# EAGLE design POE_V3 (EAGLE 9.6.2)
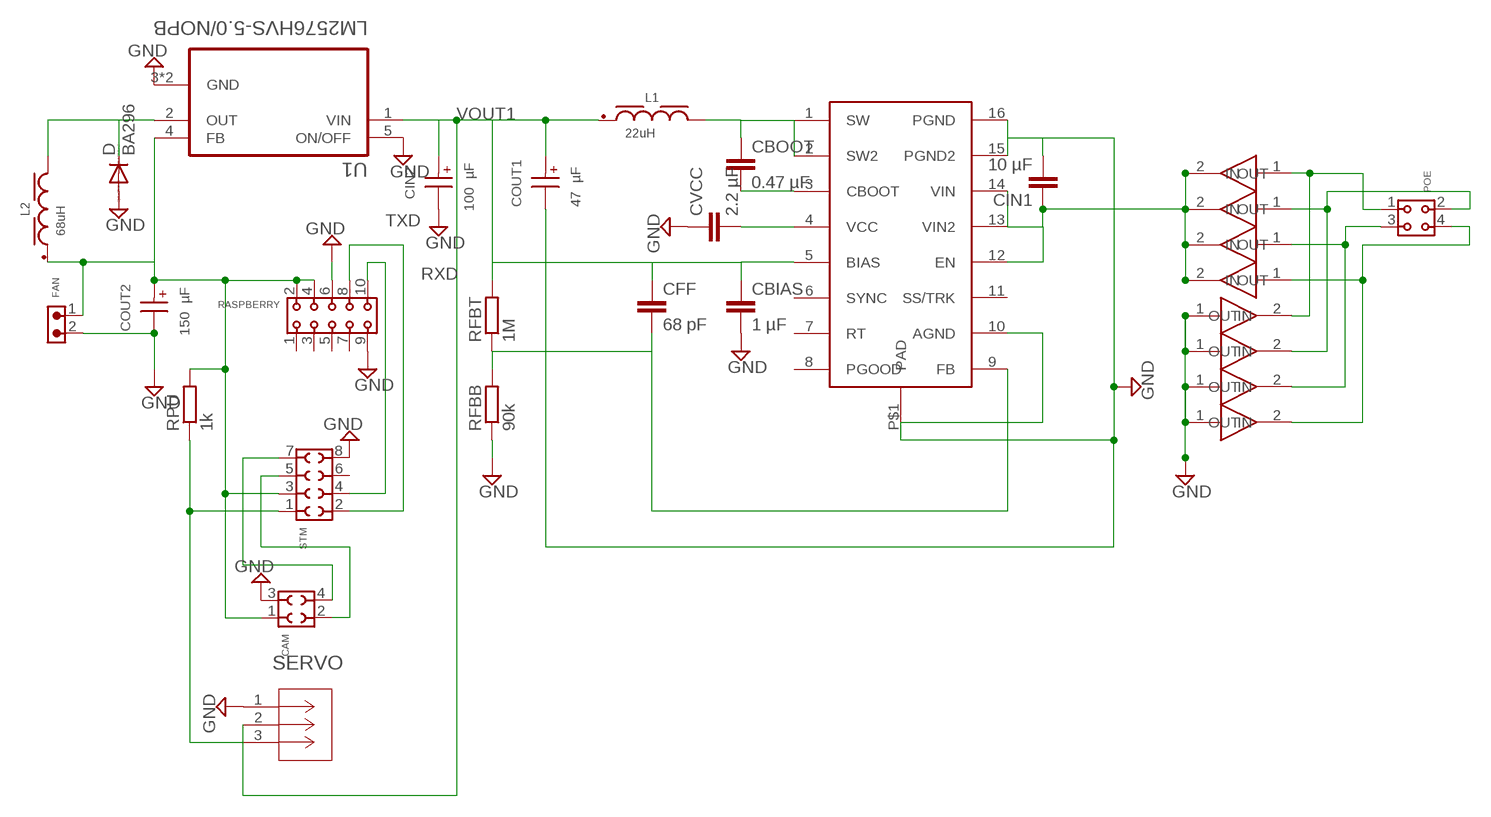
[diagram p0: schematic, sheet 1]

## Parts
CAM  6100XX21821_61000421821  [61000421821]
CBIAS  1 µF  C-EUC1206  [C1206]
CBOOT  0.47 µF  C-EUC1206  [C1206]
CFF  68 pF  C-EUC1206  [C1206]
CIN1  10 µF  C-EUC2220K  [C2220K]
CIN2  100 µF  WCAP-ASLI_6.3X5.5_865080343009  [WCAP-ASLI_6.3X5.5(DXL)]
COUT1  47 µF  WCAP-ASLI_5X5.5_865080342006  [WCAP-ASLI_5X5.5(DXL)]
COUT2  150 µF  WCAP-ASLI_6.3X5.5_865080143008  [WCAP-ASLI_6.3X5.5(DXL)]
CVCC  2.2 µF  C-EUC1206  [C1206]
D  BA296  [P2-15]
FAN  6130XX11021_61300211021  [61300211021]
L1  22uH  WE-PD_1260_744771122  [WE-PD_1260]
L2  68uH  WE-PD_1210_7447709680  [WE-PD_1210]
POE  6130XX21821_61300421821  [61300421821]
RASPBERRY  6130XX21821_61301021821  [61301021821]
RFBB  90k  R-EU_M1206  [M1206]
RFBT  1M  R-EU_M1206  [M1206]
RPU  1k  R-EU_M1206  [M1206]
SERVO  22035035  [CON_22035035]
STM  6100XX21821_61000821821  [61000821821]
U1  LM2576HVS-5.0/NOPB  [VREG_TPS79625KTTR]
U$1  LM46002  [TSSOP16]
U$2  RGF1D  [RGF1D]
U$3  RGF1D  [RGF1D]
U$4  RGF1D  [RGF1D]
U$5  RGF1D  [RGF1D]
U$6  RGF1D  [RGF1D]
U$7  RGF1D  [RGF1D]
U$8  RGF1D  [RGF1D]
U$9  RGF1D  [RGF1D]

## Nets
GND: CAM.3 CBIAS.2 CIN1.2 CIN2.2(-) COUT1.2(-) COUT2.2(-) CVCC.1 D.A FAN.2 RASPBERRY.6 RASPBERRY.9 RFBB.1 SERVO.1 STM.8 U1.3(GND) U1.5(ON/OFF) U1.6(GND) U$1.10(AGND) U$1.15(PGND2) U$1.16(PGND) U$1.P$1(PAD) U$4.1(IN) U$5.1(IN) U$8.1(IN) U$9.1(IN)
N$1: CBOOT.1 L1.2 U$1.1(SW) U$1.2(SW2)
N$2: CBOOT.2 U$1.3(CBOOT)
N$3: CVCC.2 U$1.4(VCC)
N$4: POE.1 U$2.1(IN) U$4.2(OUT)
N$5: POE.2 U$3.1(IN) U$5.2(OUT)
N$6: D.C L2.2 U1.2(OUT)
N$7: CAM.4 STM.7
N$8: CAM.2 STM.5
N$9: RPU.1 SERVO.3 STM.1
N$10: POE.3 U$6.1(IN) U$8.2(OUT)
N$11: POE.4 U$7.1(IN) U$9.2(OUT)
RFBT: CFF.2 RFBB.2 RFBT.1 U$1.9(FB)
RXD: RASPBERRY.10 STM.4
TXD: RASPBERRY.8 STM.2
VIN: CIN1.1 U$1.12(EN) U$1.13(VIN2) U$1.14(VIN) U$2.2(OUT) U$3.2(OUT) U$6.2(OUT) U$7.2(OUT)
VOUT1: CBIAS.1 CFF.1 CIN2.1(+) COUT1.1(+) L1.1 RFBT.2 SERVO.2 U1.1(VIN) U$1.5(BIAS)
VOUT2: CAM.1 COUT2.1(+) FAN.1 L2.1 RASPBERRY.2 RASPBERRY.4 RPU.2 STM.3 U1.4(FB)
Unconnected: RASPBERRY.1 RASPBERRY.3 RASPBERRY.5 RASPBERRY.7 STM.6 U$1.6(SYNC) U$1.7(RT) U$1.8(PGOOD) U$1.11(SS/TRK)

## Library data of the parts
CAM = Eagle_WR-PHD (rev19a):6100XX21821_61000421821: WR-PHD 2.54mm SMT Socket Header ARTICLE PROPERTIES Pins: 4;​ 6;​ 8;​ 10;​ 12;​ 14;​ 16;​ 18;​ 20;​ 22;​ 24;​ 26;​ 28;​ 30;​ 32;​ 34;​ 36;​ 40 KIND PROPERTIES Pitch 2.54 mm Quality Class 3 as per CECC 75 301-802 Rows Dual Gender Socket Header Type Straight MATERIAL PROPERTIES Insulator Material PA9T Insulator Flammability Rating UL94 V-0 Contact Material Copper Alloy Contact Plating Gold Contact Type Stamped GENERAL INFORMATION Operating Temperature -40 up to +105 °C Compliance Lead free / RoHS ELECTRICAL PROPERTIES Rated Current 3 A;​ max. IR 1 3 A Withstanding Voltage 600 V (AC) Contact Resistance 20 mΩ RISO 1000 MΩ PACKAGING PROPERTIES Packaging Tube <https://katalog.we-online.com/media/images/v2/o33206v209%20Family_WR-PHD_610xxx21821.jpg> Details see: http://katalog.we-online.de/en/em/PHD_2_54_SMT_DUAL_SOCKET_HEADER_6100XX21821 Updated by Ella Wu 2019-06-12 2019 (C) Würth Elektronik; DATASHEET-URL: https://katalog.we-online.com/em/datasheet/61000421821.pdf; GENDER: Socket Header; IR: 3A; MATES: WR-PHD 2.54mm SMT Dual Pin Header/THT Angled Dual Pin Header/THT Dual Board Stacker/THT Dual Pin Header; PACKAGING: Tube; PART-NUMBER: 61000421821; PINS: 4; ROWS: Dual; TYPE: Straight; WE-NUMBER: 61000421821
CBIAS CBOOT CFF CVCC = rcl:C-EU: CAPACITOR, European symbol
CIN1 = rcl:C-EU: CAPACITOR, European symbol; SPICEPREFIX: C
CIN2 = Eagle_WCAP-ASLI (rev20a):WCAP-ASLI_6.3X5.5: WCAP-ASLI Aluminium Electrolytic Capacitors Low Impedance +105 °C Characteristics Low impedance product series Mounting style: V-Chip SMT Capacitance range: 0.1 µF ‒ 6800 µF Capacitance tolerance: ±20 % Voltage range (UR): 6.3 ‒ 100 V(DC) Operating temperature: -55 °C up to +105 °C Endurance: 2000 h @ +105 °C Dimensions (DxL) in mm: 4.0 x 5.5 up to 16.0 x 17.0 Recommended soldering: Reflow soldering Applications Low impedance, especially for filtering applications Input and output capacitor for switched-mode power supply Filtering Smoothing e.g. DC/DC converter, AC/DC converter, satellite receiver, control panel <https://www.we-online.com/catalog/media/o14723v209%20Family_WCAP-ASLI.jpg> Details see: https://www.we-online.com/catalog/en/WCAP-ASLI/ Updated by yingchun,Shan;2020-03-03 2020(C) Würth Elektronik; DATASHEET-URL: https://www.we-online.com/catalog/datasheet/865080343009.pdf; DF: 16%; DIAMETER: 6.3mm; I-LEAK: 16uA; I-RIPPLE: 255mA; L: 5.5mm; OPERATING-TEMPERATURE: -55 °C up to +105 °C; PART-NUMBER: 865080343009; TECHNICAL-REFERENCE: ASED055101M016DVCTBB000; VR: 16V(DC)
COUT1 = Eagle_WCAP-ASLI (rev20a):WCAP-ASLI_5X5.5: WCAP-ASLI Aluminium Electrolytic Capacitors Low Impedance +105 °C Characteristics Low impedance product series Mounting style: V-Chip SMT Capacitance range: 0.1 µF ‒ 6800 µF Capacitance tolerance: ±20 % Voltage range (UR): 6.3 ‒ 100 V(DC) Operating temperature: -55 °C up to +105 °C Endurance: 2000 h @ +105 °C Dimensions (DxL) in mm: 4.0 x 5.5 up to 16.0 x 17.0 Recommended soldering: Reflow soldering Applications Low impedance, especially for filtering applications Input and output capacitor for switched-mode power supply Filtering Smoothing e.g. DC/DC converter, AC/DC converter, satellite receiver, control panel <https://www.we-online.com/catalog/media/o14723v209%20Family_WCAP-ASLI.jpg> Details see: https://www.we-online.com/catalog/en/WCAP-ASLI/ Updated by yingchun,Shan;2020-03-03 2020(C) Würth Elektronik; DATASHEET-URL: https://www.we-online.com/catalog/datasheet/865080342006.pdf; DF: 16%; DIAMETER: 5mm; I-LEAK: 7.52uA; I-RIPPLE: 195mA; L: 5.5mm; OPERATING-TEMPERATURE: -55 °C up to +105 °C; PART-NUMBER: 865080342006; TECHNICAL-REFERENCE: ASEC055470M016DVCTBB000; VR: 16V(DC)
COUT2 = Eagle_WCAP-ASLI (rev20a):WCAP-ASLI_6.3X5.5: WCAP-ASLI Aluminium Electrolytic Capacitors Low Impedance +105 °C Characteristics Low impedance product series Mounting style: V-Chip SMT Capacitance range: 0.1 µF ‒ 6800 µF Capacitance tolerance: ±20 % Voltage range (UR): 6.3 ‒ 100 V(DC) Operating temperature: -55 °C up to +105 °C Endurance: 2000 h @ +105 °C Dimensions (DxL) in mm: 4.0 x 5.5 up to 16.0 x 17.0 Recommended soldering: Reflow soldering Applications Low impedance, especially for filtering applications Input and output capacitor for switched-mode power supply Filtering Smoothing e.g. DC/DC converter, AC/DC converter, satellite receiver, control panel <https://www.we-online.com/catalog/media/o14723v209%20Family_WCAP-ASLI.jpg> Details see: https://www.we-online.com/catalog/en/WCAP-ASLI/ Updated by yingchun,Shan;2020-03-03 2020(C) Würth Elektronik; DATASHEET-URL: https://www.we-online.com/catalog/datasheet/865080143008.pdf; DF: 24%; DIAMETER: 6.3mm; I-LEAK: 9.45uA; I-RIPPLE: 235mA; L: 5.5mm; OPERATING-TEMPERATURE: -55 °C up to +105 °C; PART-NUMBER: 865080143008; TECHNICAL-REFERENCE: ASED055151M6R3DVCTBB000; VR: 6.3V(DC)
D = diode:BA296: DIODE
FAN = Eagle_WR-PHD (rev19a):6130XX11021_61300211021: WR-PHD 2.54 mm THT Angled Pin Header ARTICLE PROPERTIES: Pins:2;​ 3;​ 4;​ 5;​ 6;​ 7;​ 8;​ 9;​ 10;​ 12;​ 14;​ 16;​ 18;​ 22;​ 32;​ 34;​ 36;​ 40 KIND PROPERTIES: Pitch：2.54 mm Quality Class:3 as per CECC 75 301-802 Rows：Single Gender：Pin Header Type：Angled MATERIAL PROPERTIES: Insulator Material :PA6T Insulator Flammability Rating:UL94 V-0 Contact Material:Copper Alloy Contact Plating:Gold Contact Type:Stamped GENERAL INFORMATION Operating Temperature:-40 up to +105 °C Compliance:Lead free / RoHS ELECTRICAL PROPERTIES: Rated Current:3 A IR 1:3 A Withstanding Voltage:500 V (AC) Contact Resistance:20 mΩ RISO:1000 MΩ CERTIFICATION UL Approval:E323964 PACKAGING PROPERTIES Packaging:Bag <https://katalog.we-online.com/media/images/v2/o33210v209%20Family_WR-PHD_6130xx11021.jpg> Details see: https://katalog.we-online.com/en/em/PHD_2_54_THT_ANGLED_PIN_HEADER_6130XX11021 Updated by Yingchun,Shan 2019-10-16 2019 (C) Würth Elektronik; DATASHEET-URL: https://katalog.we-online.com/em/datasheet/61300211021.pdf; GENDER: Pin Header; IR: 3A; MATES: WR-PHD 2.5mm Angled Socket Header/SMT Socket Header/Socket Header/Soket Header Bottom Entry; PACKAGING: Bag; PART-NUMBER: 61300211021; PINS: 2; ROWS: Single; TYPE: Angled
L1 = Eagle_WE-PD (rev20a):WE-PD_1260: WE-PD SMT Power Inductor Characteristics AECQ 200 Qualified Ultra low RDC and RAC Highest possible saturation current based on Ferrite Suitable for switching frequency up to 10MHz Temperature dependent parameter available on Redexpert Operating Temperature from -40°C to +125°C / +150°C Types WE-PD: Since always with low loss material, tight tolerances and high saturation behavior compared to other manufacturers in the market WE-PD Robust: Plastic base improves the mechanical stability and efficiency WE-PD Performance: MnZn core improves Saturation and RDC for highest efficiency Applications Switch Mode Power supplies from 0,1W up to 300W Integrated DC DC Converter Ideal for Switch Mode Power supplies with extreme high efficiency (>95%) <https://www.we-online.com/catalog/media/o14825v209%20Family_WE-PD.jpg> Details see: https://www.we-online.com/catalog/en/WE-PD/ Updated by Yingchun,Shan 2019-07-25 2019 (C) Wurth Elektronik; DATASHEET-URL: https://www.we-online.com/catalog/datasheet/744771122.pdf; FRES: 13.5MHz; IR: 3.37A; ISAT: 3.77A; MOUNT: SMT; PART-NUMBER: 744771122; RDC-MAX: 36mOhm; RDC-TYP: 31mOhm; VERSION: Standard
L2 = Eagle_WE-PD (rev20a):WE-PD_1210: WE-PD SMT Power Inductor Characteristics AECQ 200 Qualified Ultra low RDC and RAC Highest possible saturation current based on Ferrite Suitable for switching frequency up to 10MHz Temperature dependent parameter available on Redexpert Operating Temperature from -40°C to +125°C / +150°C Types WE-PD: Since always with low loss material, tight tolerances and high saturation behavior compared to other manufacturers in the market WE-PD Robust: Plastic base improves the mechanical stability and efficiency WE-PD Performance: MnZn core improves Saturation and RDC for highest efficiency Applications Switch Mode Power supplies from 0,1W up to 300W Integrated DC DC Converter Ideal for Switch Mode Power supplies with extreme high efficiency (>95%) <https://www.we-online.com/catalog/media/o14825v209%20Family_WE-PD.jpg> Details see: https://www.we-online.com/catalog/en/WE-PD/ Details see: https://katalog.we-online.com/en/pbs/WE-PD Updated by Yingchun,Shan 2019-07-25 2019 (C) Wurth Elektronik; DATASHEET-URL: https://www.we-online.com/catalog/datasheet/7447709680.pdf; FRES: 5.5MHz; IR: 3.2A; ISAT: 3.6A; MOUNT: SMT; PART-NUMBER: 7447709680; RDC-MAX: 89mOhm; RDC-TYP: 69mOhm; VERSION: Standard
POE = Eagle_WR-PHD (rev19a):6130XX21821_61300421821: WR-PHD 2.54 mm Dual Socket Header ARTICLE PROPERTIES: Pins:4;​ 6;​ 8;​ 10;​ 12;​ 14;​ 16;​ 18;​ 20;​ 22;​ 24;​ 26;​ 28;​ 30;​ 32;​ 34;​ 36;​ 40;​ 44;​ 64;​ 72 KIND PROPERTIES: Pitch：2.54 mm Quality Class:3 as per CECC 75 301-802 Rows：Dual Gender：Socket Header Type：Straight MATERIAL PROPERTIES: Insulator Material :PBT Insulator Flammability Rating:UL94 V-0 Contact Material:Copper Alloy Contact Plating:Gold Contact Type:Stamped GENERAL INFORMATION Operating Temperature:-40 up to +125 °C Compliance:Lead free / RoHS ELECTRICAL PROPERTIES: Rated Current:3 A IR 1:3 A Withstanding Voltage:500 V (AC) Contact Resistance:20 mΩ RISO:1000 MΩ CERTIFICATION UL Approval:E323964 PACKAGING PROPERTIES Packaging:Tray <https://katalog.we-online.com/media/images/v2/o57948v209%20Family_Dual_Socket_Header_WR-PHD_6130xx21821.jpg> Details see: https://katalog.we-online.com/en/em/PHD_2_54_DUAL_SOCKET_HEADER_6130XX21821 Updated by Yingchun,Shan 2019-10-21 2019 (C) Würth Elektronik; DATASHEET-URL: https://katalog.we-online.com/em/datasheet/61300421821.pdf; GENDER: Socket Header; IR: 3A; MATES: WR-PHD 2.54mm SMT Dual Pin Header/THT Angled Dual Pin Header/THT Dual Board Stacker/THT Dual Pin Header; PACKAGING: Tray; PART-NUMBER: 61300421821; PINS: 4; ROWS: Dual; TYPE: Straight
RASPBERRY = Eagle_WR-PHD (rev19a):6130XX21821_61301021821: WR-PHD 2.54 mm Dual Socket Header ARTICLE PROPERTIES: Pins:4;​ 6;​ 8;​ 10;​ 12;​ 14;​ 16;​ 18;​ 20;​ 22;​ 24;​ 26;​ 28;​ 30;​ 32;​ 34;​ 36;​ 40;​ 44;​ 64;​ 72 KIND PROPERTIES: Pitch：2.54 mm Quality Class:3 as per CECC 75 301-802 Rows：Dual Gender：Socket Header Type：Straight MATERIAL PROPERTIES: Insulator Material :PBT Insulator Flammability Rating:UL94 V-0 Contact Material:Copper Alloy Contact Plating:Gold Contact Type:Stamped GENERAL INFORMATION Operating Temperature:-40 up to +125 °C Compliance:Lead free / RoHS ELECTRICAL PROPERTIES: Rated Current:3 A IR 1:3 A Withstanding Voltage:500 V (AC) Contact Resistance:20 mΩ RISO:1000 MΩ CERTIFICATION UL Approval:E323964 PACKAGING PROPERTIES Packaging:Tray <https://katalog.we-online.com/media/images/v2/o57948v209%20Family_Dual_Socket_Header_WR-PHD_6130xx21821.jpg> Details see: https://katalog.we-online.com/en/em/PHD_2_54_DUAL_SOCKET_HEADER_6130XX21821 Updated by Yingchun,Shan 2019-10-21 2019 (C) Würth Elektronik; DATASHEET-URL: https://katalog.we-online.com/em/datasheet/61301021821.pdf; GENDER: Socket Header; IR: 3A; MATES: WR-PHD 2.54mm SMT Dual Pin Header/THT Angled Dual Pin Header/THT Dual Board Stacker/THT Dual Pin Header; PACKAGING: Tray; PART-NUMBER: 61301021821; PINS: 10; ROWS: Dual; TYPE: Straight
RFBB RFBT RPU = resistor:R-EU_: RESISTOR, European symbol
SERVO = Port_Servo:22035035; BUILT_BY: Molex_Team; COPYRIGHT: Copyright (C) 2018 Accelerated Designs. All rights reserved; MANUFACTURER_PART_NUMBER: 22035035; SOURCELIBRARY: Add_to_database_2021-02-22; VENDOR: Molex Connector Corporation
STM = Eagle_WR-PHD (rev19a):6100XX21821_61000821821: WR-PHD 2.54mm SMT Socket Header ARTICLE PROPERTIES Pins: 4;​ 6;​ 8;​ 10;​ 12;​ 14;​ 16;​ 18;​ 20;​ 22;​ 24;​ 26;​ 28;​ 30;​ 32;​ 34;​ 36;​ 40 KIND PROPERTIES Pitch 2.54 mm Quality Class 3 as per CECC 75 301-802 Rows Dual Gender Socket Header Type Straight MATERIAL PROPERTIES Insulator Material PA9T Insulator Flammability Rating UL94 V-0 Contact Material Copper Alloy Contact Plating Gold Contact Type Stamped GENERAL INFORMATION Operating Temperature -40 up to +105 °C Compliance Lead free / RoHS ELECTRICAL PROPERTIES Rated Current 3 A;​ max. IR 1 3 A Withstanding Voltage 600 V (AC) Contact Resistance 20 mΩ RISO 1000 MΩ PACKAGING PROPERTIES Packaging Tube <https://katalog.we-online.com/media/images/v2/o33206v209%20Family_WR-PHD_610xxx21821.jpg> Details see: http://katalog.we-online.de/en/em/PHD_2_54_SMT_DUAL_SOCKET_HEADER_6100XX21821 Updated by Ella Wu 2019-06-12 2019 (C) Würth Elektronik; DATASHEET-URL: https://katalog.we-online.com/em/datasheet/61000821821.pdf; GENDER: Socket Header; IR: 3A; MATES: WR-PHD 2.54mm SMT Dual Pin Header/THT Angled Dual Pin Header/THT Dual Board Stacker/THT Dual Pin Header; PACKAGING: Tube; PART-NUMBER: 61000821821; PINS: 8; ROWS: Dual; TYPE: Straight; WE-NUMBER: 61000821821
U1 = LM2576HVS-5.0_NOPB:LM2576HVS-5.0/NOPB; DESCRIPTION: SIMPLE SWITCHER&reg; 4V to 60V, 3A Low Component Count Step-Down Regulator 5-DDPAK/TO-263 -40 to 125; DIGI-KEY_PART_NUMBER: LM2576HVS-5.0/NOPB-ND; MF: Texas Instruments; MP: LM2576HVS-5.0/NOPB; PACKAGE: TO-263-5 Texas Instruments; PURCHASE-URL: https://pricing.snapeda.com/search/part/LM2576HVS-5.0/NOPB/?ref=eda
U$1 = analog-devices-3:LM46002
U$2-U$9 = RGF1D:RGF1D

## Board
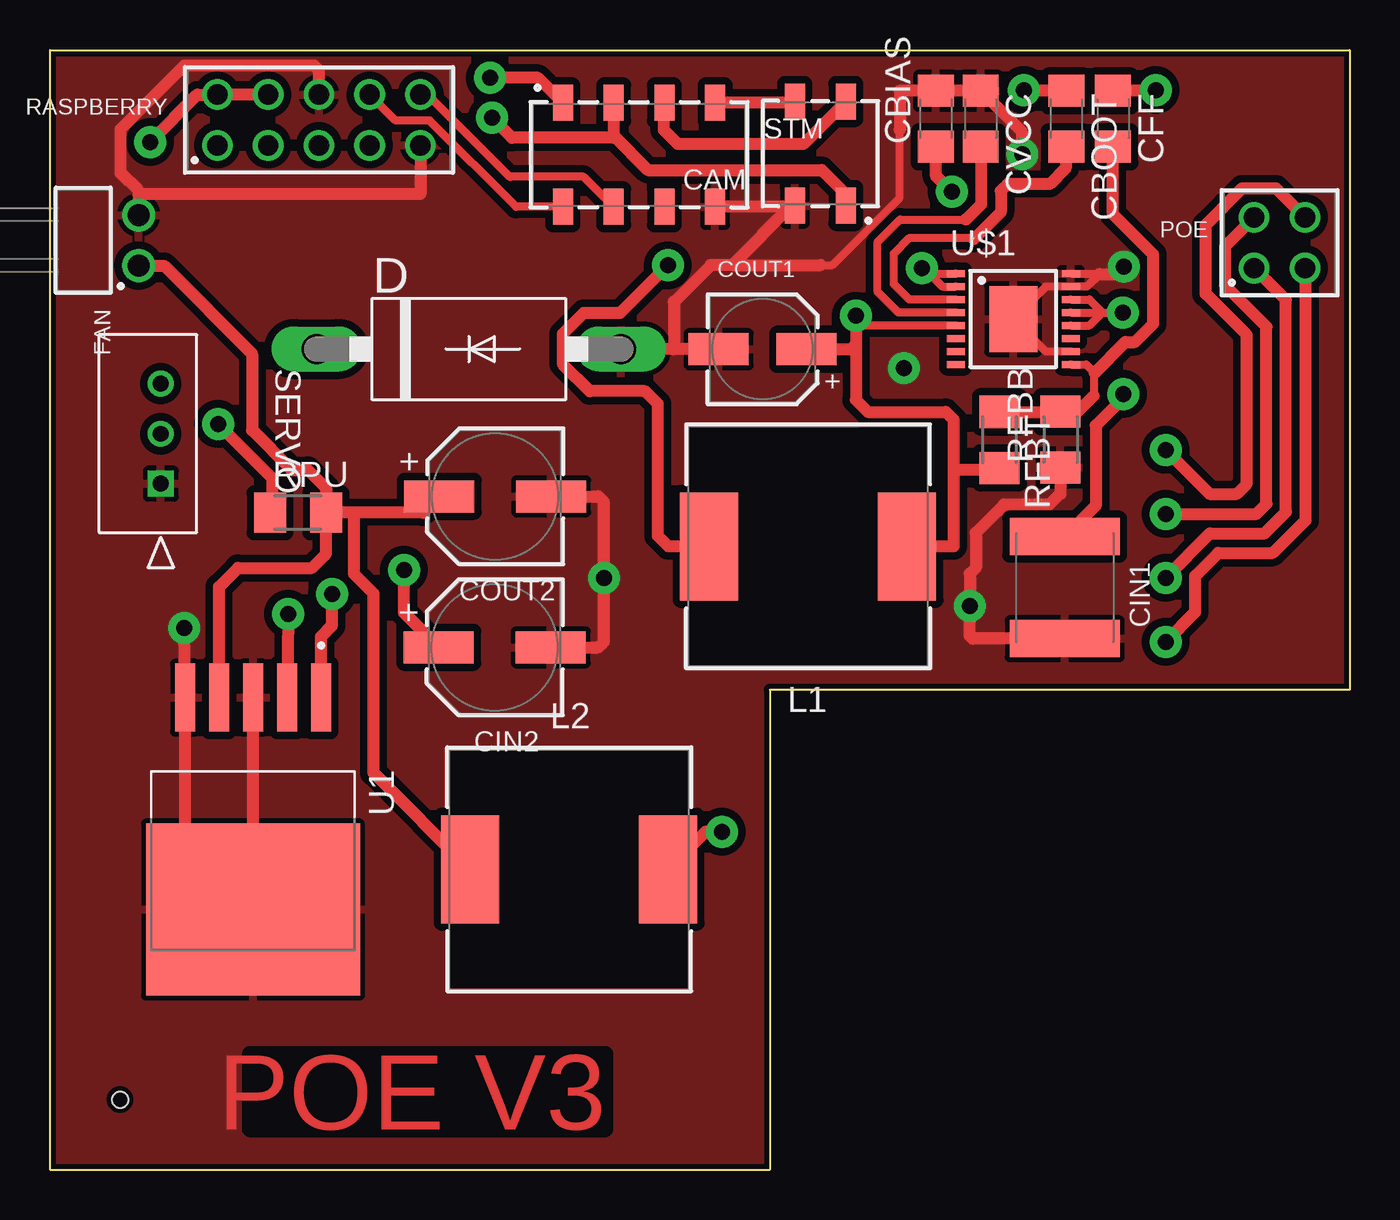
[diagram p1: board, top side]
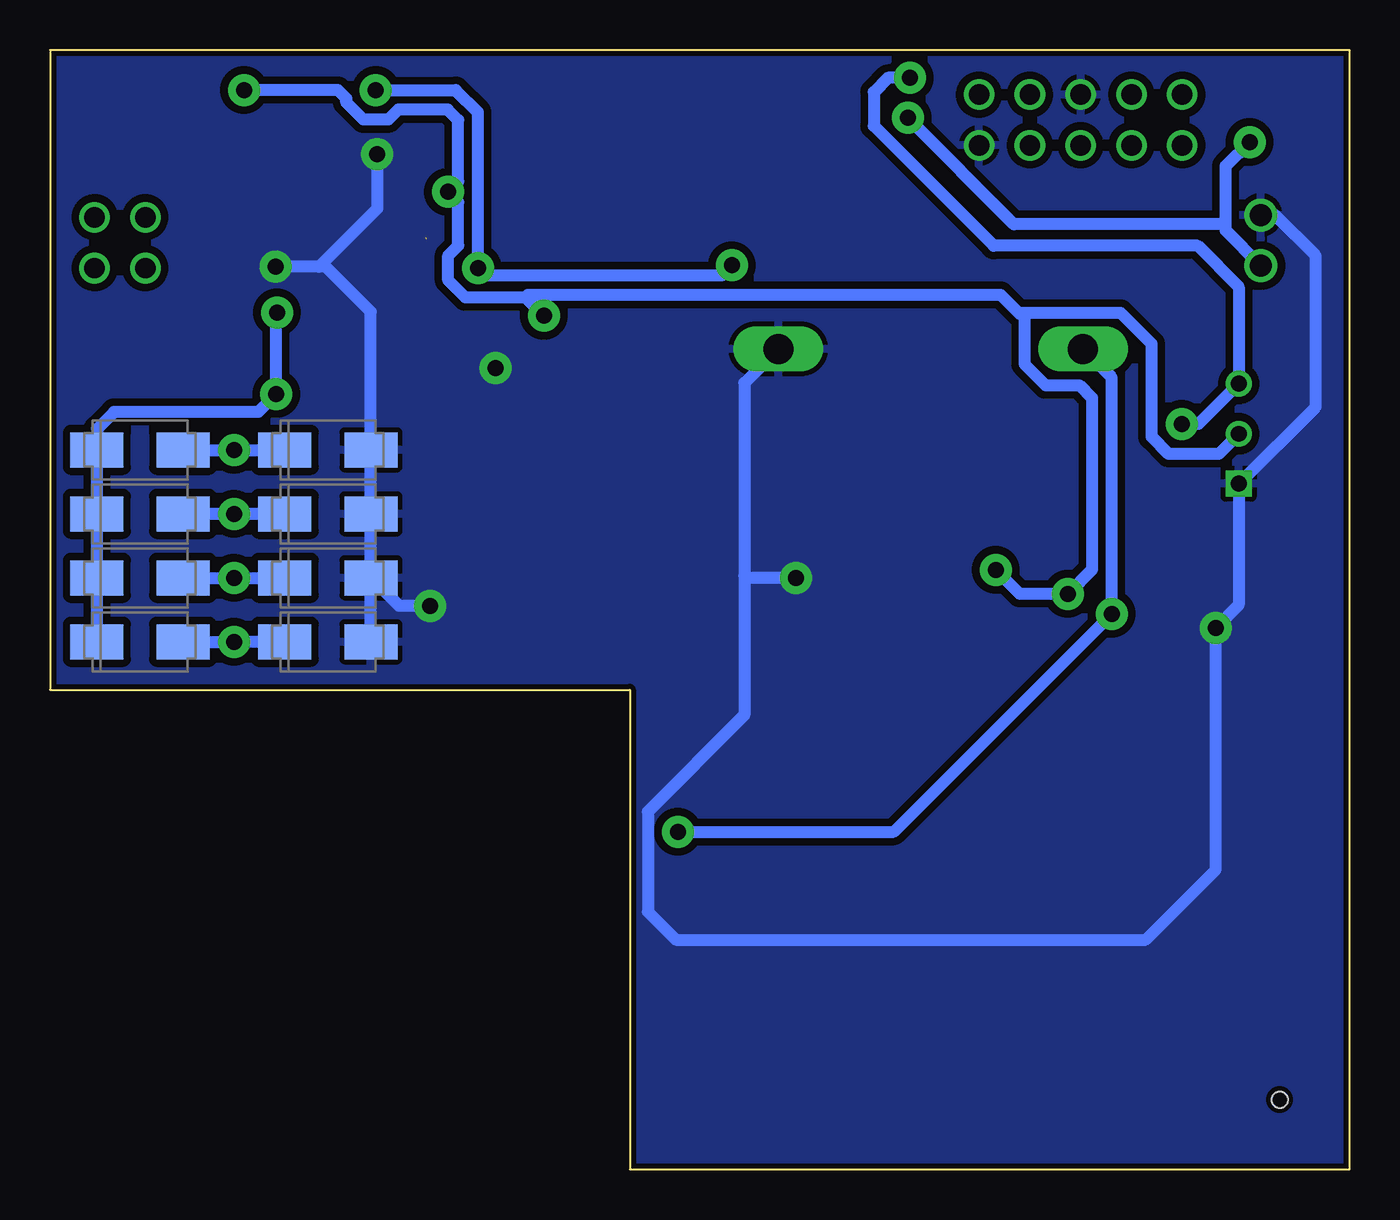
[diagram p2: board, bottom side, seen from below]

Size 65 x 56 mm. Coordinates in mm from the lower left corner, seen from the top.
Outline: 0,0 0,56 65,56 65,24 36,24 36,0 0,0
Copper layers (1*16): Top 0.035mm / dielectric 1.5mm / Bottom 0.035mm
Design rules "default *": minimum track width 6mil, minimum drill 0.35mm, track to track 15mil, track to pad 15mil, pad to pad 15mil, via to via 15mil, smd to smd 15mil, copper to edge 10mil, drill to drill 6mil, minimum pad ring 10mil, minimum via ring 8mil, stop-mask expansion 4mil, vias tented up to drill 0mil, thermal gap 10mil
Holes 0.8 mm at 3.5,3.5

### Footprints (pad centres in the part's own frame; a part is rotated, then mirrored left to right if it is on the bottom)
61000421821 = smd 1 x 1.8: 1 -1.27,2.6; 2 -1.27,-2.6; 3 1.27,2.6; 4 1.27,-2.6
C1206 = smd 1.6 x 1.8: 1 -1.4,0; 2 1.4,0
C2220K = smd 1.85 x 5.5: 1 -2.55,0; 2 2.55,0
WCAP-ASLI_6.3X5.5(DXL) = smd 3.5 x 1.6: 1 2.8,0; 2 -2.8,0
WCAP-ASLI_5X5.5(DXL) = smd 3 x 1.6: 1 2.2,0; 2 -2.2,0
P2-15 = drill 1.499 long: A 7.62,0; C -7.62,0
61300211021 = drill 1.1: 1 1.27,2.77; 2 -1.27,2.77
WE-PD_1260 = smd 2.9 x 5.4: 1 -4.95,0; 2 4.95,0
WE-PD_1210 = smd 2.9 x 5.4: 1 -4.95,0; 2 4.95,0
61300421821 = drill 1.02: 1 -1.27,-1.27; 2 -1.27,1.27; 3 1.27,-1.27; 4 1.27,1.27
61301021821 = drill 1.02: 1 -5.08,-1.27; 2 -5.08,1.27; 3 -2.54,-1.27; 4 -2.54,1.27; 5 0,-1.27; 6 0,1.27; 7 2.54,-1.27; 8 2.54,1.27; 9 5.08,-1.27; 10 5.08,1.27
M1206 = smd 1.6 x 2: 1 -1.4,0; 2 1.4,0
CON_22035035 = drill 0.787 pad 1.143 square: 1 0,0 | drill 0.787 pad 1.143: 2 -2.489,0; 3 -5.004,0
61000821821 = smd 1 x 1.8: 1 -3.81,2.6; 2 -3.81,-2.6; 3 -1.27,2.6; 4 -1.27,-2.6; 5 1.27,2.6; 6 1.27,-2.6; 7 3.81,2.6; 8 3.81,-2.6
VREG_TPS79625KTTR = smd 3.4 x 1: 1 -10.6,3.4; 2 -10.6,1.7; 3 -10.6,0; 4 -10.6,-1.7; 5 -10.6,-3.4 | smd 8.6 x 10.7: 6 0,0
TSSOP16 = smd 0.9 x 0.35: 1 -2.875,2.275; 2 -2.875,1.625; 3 -2.875,0.975; 4 -2.875,0.325; 5 -2.875,-0.325; 6 -2.875,-0.975; 7 -2.875,-1.625; 8 -2.875,-2.275; 9 2.875,-2.275; 10 2.875,-1.625; 11 2.875,-0.975; 12 2.875,-0.325; 13 2.875,0.325; 14 2.875,0.975; 15 2.875,1.625; 16 2.875,2.275 | smd 2.41 x 3.29: P$1 0,0
RGF1D = smd 2.65 x 1.75: 1 -2.15,0; 2 2.15,0

### Placement (x,y rotation side)
CAM  38.53,50.82 180 top
CBIAS  44.32,52.56 90 top
CBOOT  50.83,52.56 270 top
CFF  53.17,52.56 270 top
CIN1  50.76,29.11 270 top
CIN2  22.24,26.12 180 top
COUT1  35.64,41.03 0 top
COUT2  22.27,33.67 180 top
CVCC  46.55,52.56 270 top
D  20.95,41.04 0 top
FAN  1.66,46.48 270 top
L1  37.92,31.17 180 top
L2  25.97,15.02 0 top
POE  61.5,46.36 0 top
RASPBERRY  13.45,52.5 0 top
RFBB  50.54,36.51 90 top
RFBT  47.49,36.5 270 top
RPU  12.4,32.86 0 top
SERVO  5.54,34.31 270 top
STM  29.46,50.76 0 top
U1  10.15,13.01 270 top
U$1  48.18,42.54 0 top
U$2  60.5,29.6 180 bottom
U$3  60.5,32.8 180 bottom
U$4  51.1,29.6 180 bottom
U$5  51.1,32.8 180 bottom
U$6  60.5,26.4 180 bottom
U$7  60.5,36 180 bottom
U$8  51.1,26.4 180 bottom
U$9  51.1,36 180 bottom

### Tracks (layer width: path | path; a pad name or v marks a point on that pad's centre or on a via)
GND  (via drill 0.8 pad 1.6)
  Top 0.4: U$1.10 49.8,40.91 U$1.P$1 49.8,44.16 U$1.15 51.87,44.16 52.5,44.8 52.48,44.81 U$1.16 | 38.55,45.25 39.13,45.25 42.5,48.62 42.5,52
  Top 0.6: COUT1.2 31.2,41.03 | 31.2,41.03 D.A | 31.2,41.03 31.2,43.4 33.05,45.25 34.1,45.25 | 42.5,52 42.5,53.96 CBIAS.2 CVCC.1 48.6,51.91 48.6,50.8 v48.63,50.8 | 34.1,45.25 38.55,45.25 | U1.3 U1.6 6.75,16.41 U1.5 v6.7,27.1 | STM.8 37.2,48.16 CAM.3 37.07,48.22 34.1,45.25 | RASPBERRY.9 18.53,48.8 4.48,48.8 4.43,48.75 FAN.2 4.43,48.95 3.52,49.86 3.52,52.01 6.72,55.22 13.21,55.22 13.45,54.98 RASPBERRY.6 | CIN2.2 27.42,26.12 27.7,26.4 v27.7,29.6 27.7,33.4 27.43,33.67 COUT2.2 | 52.5,44.8 53.35,44.8 v53.7,45.15 | RFBB.1 50.54,33.81 50,33.27 47.73,33.27 46.3,31.84 46.3,30.1 46,29.8 v46,28.2 46,26.7 46.14,26.56 CIN1.2
  Bottom 0.6: 30.27,29.7 30.27,39.34 D.A | 30.27,29.7 30.27,22.73 35.1,17.9 35.1,12.9 33.7,11.5 10.2,11.5 6.7,15 v6.7,27.1 5.54,28.26 SERVO.1 1.7,38.15 1.7,45.7 3.75,47.75 FAN.2 | v27.7,29.6 30.17,29.6 30.27,29.7 | v48.63,50.8 48.63,48.07 51.55,45.15 | 51.55,45.15 v53.7,45.15 | U$8.1 U$4.1 | U$4.1 U$5.1 U$9.1 48.95,42.9 51.2,45.15 51.55,45.15 | v46,28.2 47.55,28.2 U$4.1
  other vias: 42.7,40.1
  pour Top: 0,56 0,0 36,0 36,24 65,24 65,56
  pour Bottom: 0,56 0,0 36,0 36,24 65,24 65,56
N$1  (via drill 0.8 pad 1.6)
  Top 0.4: U$1.1 44,44.8 | 44,44.8 43.9,44.8 v43.6,45.1 | 44,44.8 44.63,44.16 U$1.2
  Top 0.6: v48.7,54 50.79,54 CBOOT.1 | v30.9,45.23 28.51,42.84 26.7,42.84 25.64,41.79 25.64,40.29 27,38.93 29.77,38.93 30.4,38.3 30.4,31.7 30.93,31.17 L1.2
  Bottom 0.6: v48.7,54 44.7,54 43.6,52.9 v43.6,45.1 43.23,44.73 31.4,44.73 v30.9,45.23
N$2  (1 unrouted)
  Top 0.4: U$1.3 42.98,43.52 42.2,44.3 42.2,45.81 43,46.61 46.19,46.61 46.2,46.6
  Top 0.6: CBOOT.2 50.8,51.13 50.8,50.1 50,49.3 47.9,49.3 47.56,48.96 47.56,47.88 46.22,46.54 46.19,46.54
N$3
  Top 0.4: U$1.4 42.44,42.87 41.39,43.91 41.39,46.39 42.52,47.52 45.8,47.52
  Top 0.6: CVCC.2 46.58,51.13 46.58,48.29 45.81,47.52 45.8,47.52
N$4  (via drill 0.8 pad 1.6)
  Top 0.6: POE.1 61.82,43.5 61.82,32.89 60.74,31.82 58.02,31.82 v55.8,29.6
  Bottom 0.6: U$4.2 v55.8,29.6 U$2.1
N$5  (via drill 0.8 pad 1.6)
  Top 0.6: v55.8,32.8 60.34,32.8 60.84,33.3 60.84,42.16 58.78,44.22 58.78,46.18 POE.2
  Bottom 0.6: U$5.2 v55.8,32.8 U$3.1
N$6  (via drill 0.8 pad 1.6)
  Top 0.6: U1.2 v11.9,27.8 | v33.6,16.9 32.8,16.91 L2.2
  Bottom 0.6: D.C 11.9,39.61 v11.9,27.8 22.8,16.9 v33.6,16.9
N$7
  Top 0.6: CAM.4 37.2,53.36 STM.7
N$8
  Top 0.6: CAM.2 37.68,51.3 31.4,51.3 30.7,52 30.7,53.33 STM.5
N$9  (via drill 0.8 pad 1.6)
  Top 0.6: STM.1 24.41,54.6 v22,54.6 | v8.4,37.3 11.1,34.6 11.1,32.96 RPU.1
  Bottom 0.6: v8.4,37.3 7.55,37.3 SERVO.3 5.54,44.14 7.6,46.2 17.8,46.2 23.8,52.2 23.8,53.9 23.1,54.6 v22,54.6
N$10  (via drill 0.8 pad 1.6)
  Top 0.6: POE.3 62.8,45.06 62.8,32.5 62.8,32.49 61.15,30.84 58.42,30.84 57.28,29.69 57.28,27.88 v55.8,26.4
  Bottom 0.6: U$8.2 v55.8,26.4 U$6.1
N$11  (via drill 0.8 pad 1.6)
  Top 0.6: POE.4 61.32,49.08 59.63,49.08 57.8,47.25 57.8,43.81 59.86,41.76 59.86,34.3 59.36,33.8 58,33.8 v55.8,36
  Bottom 0.6: U$7.1 v55.8,36 U$9.2
RFBT
  Top 0.4: U$1.9 51.84,40.27 52.2,39.9 | 52.2,39.9 52.25,39.85 | 52.2,39.9 52.2,38.7
  Top 0.6: 52.25,39.85 53.79,41.39 54.26,41.39 55.18,42.31 55.18,45.76 53.17,47.77 CFF.2 | RFBT.1 RFBB.2 51.41,37.91 52.2,38.7
RXD
  Top 0.4: RASPBERRY.10 18.88,53.77 22.99,49.66 26.69,49.66 STM.4
TXD
  Top 0.4: STM.2 23.3,48.16 18.99,52.47 17.29,52.47 RASPBERRY.8
VIN  (via drill 0.8 pad 1.6)
  Top 0.4: U$1.13 52.64,42.87 | U$1.14 51.99,43.52 52.64,42.87 | U$1.12 51.98,42.22 52.64,42.87 | 52.64,42.87 v53.65,42.87
  Top 0.6: CIN1.1 52.3,33.2 52.3,37.22 53.68,38.6 v53.68,38.8
  Bottom 0.6: U$6.2 U$2.2 U$3.2 U$7.2 62.65,37.05 61.8,37.9 54.58,37.9 v53.68,38.8 53.68,42.84 v53.65,42.87
VOUT1  (via drill 0.8 pad 1.6)
  Top 0.4: 40.3,42.2 40.31,42.22 U$1.5
  Top 0.6: U1.1 13.55,26.65 14.1,27.2 v14.1,28.8 | v45.1,48.9 44.32,49.68 CBIAS.1 | v55.3,54 55.26,53.96 CFF.1 | CIN2.1 17.7,27.86 v17.7,30 | L1.1 45.2,31.17 45.2,35 | 40.3,41.28 40.3,42.2 v40.3,42.7 | 45.2,35 45.2,37.5 44.8,37.9 40.9,37.9 40.3,38.5 40.3,41.28 | RFBT.2 47.39,35 45.2,35 | COUT1.1 40.05,41.03 40.3,41.28
  Bottom 0.6: 16.5,42.85 16.5,42.8 17.45,43.75 41.09,43.75 41.22,43.62 | SERVO.2 6.54,35.8 9.04,35.8 9.9,36.66 9.9,41.3 11.45,42.85 16.5,42.85 | v40.3,42.7 41.22,43.62 | 41.22,43.62 44.21,43.62 45.08,44.49 45.08,45.71 44.58,46.21 44.58,48.38 v45.1,48.9 | v45.1,48.9 | v45.1,48.9 44.58,49.42 44.58,52.49 45.11,53.02 47.59,53.02 48.09,52.52 49.31,52.52 50.18,53.39 50.18,53.58 50.6,54 v55.3,54 | 16.5,42.85 16.26,42.61 16.26,40.29 15.2,39.23 13.52,39.23 12.88,38.6 12.88,30.02 v14.1,28.8 16.5,28.8 v17.7,30
VOUT2  (via drill 0.8 pad 1.6)
  Top 0.6: U1.4 8.45,29.15 9.4,30.1 13.1,30.1 13.8,30.8 RPU.2 | FAN.1 5.7,45.2 10.1,40.8 10.1,36.99 12.09,35 12.9,35 13.8,34.1 13.8,34 RPU.2 | STM.3 28.19,51.7 | 28.19,51.7 28.19,51.6 23.1,51.6 v22.1,52.6 | v5,51.4 7.37,53.77 RASPBERRY.2 RASPBERRY.4 | 28.19,51.7 29.89,50 38.6,50 39.8,48.8 CAM.1 | COUT2.1 18.66,32.86 15.2,32.86 | 15.2,32.86 RPU.2 | 15.2,32.86 15.2,29.79 16.18,28.81 16.18,19.86 L2.1
  Bottom 0.6: FAN.1 6.2,46.98 6.2,47.28 | v5,51.4 6.2,50.2 6.2,47.28 | 6.2,47.28 16.78,47.28 v22.1,52.6

### Text on the board
Top: POE V3